# Altium schematic sheet Main.SchDoc
size 127 x 50 mm; PageSetup: Record=PageOptions|CenterHorizontal=True|CenterVertical=True|PrintScale=0.71|XCorrection=1.00|YCorrection=1.00|PrintKind=1|BorderSize=5000000|LeftOffset=0|BottomOffset=0|Orientation=2|PaperLength=1000|PaperWidth=1000|Scale=100|PaperSource=15|PrintQuality=4000|MediaType=1|DitherType=10|PrintScaleMode=1|PaperKind=A4|PaperIndex=9
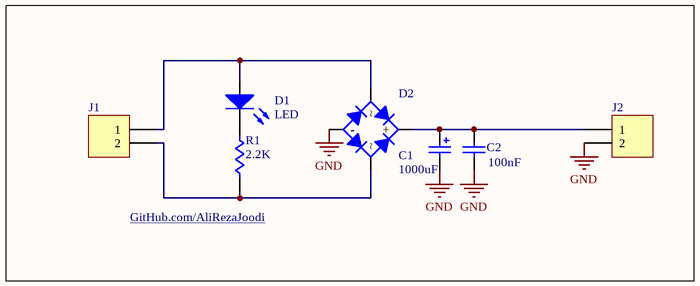
[diagram p0: Main.SchDoc]

## Parts
C1  value 1000uF  [CAPPR5-10x5]  (hidden comment: Cap Pol1)
C2  value 100nF  [CAPNTO2.54-3.05x1.78A]  (hidden comment: Cap)
D1  LED  [LED-5mm_Red]
D2  Bridge1  [BRIDGE-1]  (value not drawn)
J1  Header 2  [W2312R5MILH - duplicate]  (value not drawn)
J2  Header 2  [W2312R5MILH - duplicate]  (value not drawn)
R1  value 2.2K  [AXIAL-0.4]  (hidden comment: Res1)

## Nets
GND: C1.2 C2.1 D2.1(-) J2.2
NetC1_1: C1.1 C2.2 D2.3(+) J2.1
NetD1_1: D1.1(A) D2.2 J1.1
NetD1_2: D1.2(K) R1.1
NetD2_4: D2.4 J1.2 R1.2

## Notes on the sheet
- (near R1) GitHub.com/AliRezaJoodi

## Library data of the parts
C1 = Cap Pol1: Polarized Capacitor (Radial); Manufacturer: Generic Components; Class I: Passive; Published: 8-Jun-2000; Revision: July-2002: Re-released for DXP Platform.; Publisher: Altium Limited; Class II: Capacitor
C2 = Cap: Capacitor; Manufacturer: Generic Components; Class I: Passive; Published: 8-Jun-2000; Revision: July-2002: Re-released for DXP Platform.; Publisher: Altium Limited; Class II: Capacitor
D1 = LED: Typical INFRARED GaAs LED; Manufacturer: Generic Components; Class I: Optoelectronic; Published: 8-Jun-2000; Revision: July-2002: Re-released for DXP Platform.; Publisher: Altium Limited; Class II: LED
D2 = Bridge1: Full Wave Diode Bridge; Manufacturer: Generic Components; Class I: Discrete; Class II: Rectifier - Bridge; Published: 8-Jun-2000; Revision: July-2002: Re-released for DXP Platform.; Publisher: Altium Limited
J1 J2 = Header 2: Header, 2-Pin; LatestRevisionDate: 17-Jul-2002; LatestRevisionNote: Re-released for DXP Platform.; Publisher: Altium Limited
R1 = Res1: Resistor; Manufacturer: Generic Components; Class I: Passive; Published: 8-Jun-2000; Revision: July-2002: Re-released for DXP Platform.; Publisher: Altium Limited; Class II: Resistor